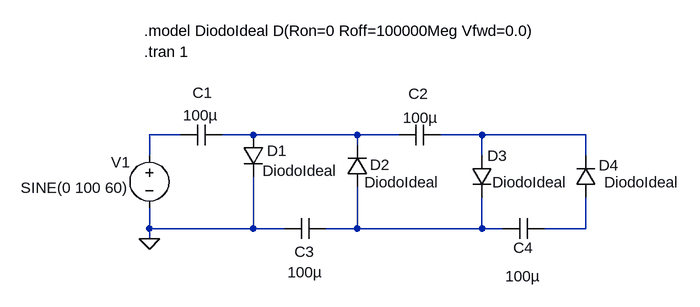
[diagram p0: schematic P1A06-Multiplicador-LTSpice.asc]
P1A06-Multiplicador-LTSpice.asc, the LTspice schematic file:
Version 4
SHEET 1 880 680
WIRE 80 112 32 112
WIRE 192 112 144 112
WIRE 352 112 192 112
WIRE 416 112 352 112
WIRE 544 112 480 112
WIRE 704 112 544 112
WIRE 352 128 352 112
WIRE 32 144 32 112
WIRE 544 144 544 112
WIRE 704 144 704 112
WIRE 32 256 32 224
WIRE 192 256 192 176
WIRE 192 256 32 256
WIRE 240 256 192 256
WIRE 352 256 352 192
WIRE 352 256 304 256
WIRE 544 256 544 208
WIRE 544 256 352 256
WIRE 576 256 544 256
WIRE 704 256 704 208
WIRE 704 256 640 256
WIRE 32 272 32 256
FLAG 32 272 0
SYMBOL cap 80 128 R270
WINDOW 0 65 34 VTop 2
WINDOW 3 62 31 VBottom 2
SYMATTR InstName C1
SYMATTR Value 100µ
SYMBOL cap 416 128 R270
WINDOW 0 64 30 VTop 2
WINDOW 3 58 33 VBottom 2
SYMATTR InstName C2
SYMATTR Value 100µ
SYMBOL cap 240 272 R270
WINDOW 0 -35 31 VTop 2
WINDOW 3 -36 32 VBottom 2
SYMATTR InstName C3
SYMATTR Value 100µ
SYMBOL cap 576 272 R270
WINDOW 0 -29 32 VTop 2
WINDOW 3 -42 31 VBottom 2
SYMATTR InstName C4
SYMATTR Value 100µ
SYMBOL diode 176 112 R0
WINDOW 0 37 24 Left 2
WINDOW 3 30 55 Left 2
SYMATTR InstName D1
SYMATTR Value DiodoIdeal
SYMBOL diode 368 192 R180
WINDOW 0 -34 34 Left 2
WINDOW 3 -111 7 Left 2
SYMATTR InstName D2
SYMATTR Value DiodoIdeal
SYMBOL diode 528 144 R0
WINDOW 3 32 41 Left 2
SYMATTR InstName D3
SYMATTR Value DiodoIdeal
SYMBOL diode 720 208 R180
WINDOW 0 -35 49 Left 2
WINDOW 3 -128 23 Left 2
SYMATTR InstName D4
SYMATTR Value DiodoIdeal
SYMBOL voltage 32 128 R0
WINDOW 123 0 0 Left 2
WINDOW 39 0 0 Left 2
WINDOW 0 -59 26 Left 2
WINDOW 3 -198 65 Left 2
SYMATTR InstName V1
SYMATTR Value SINE(0 100 60)
TEXT 24 -16 Left 2 !.tran 1
TEXT 24 -48 Left 2 !.model DiodoIdeal D(Ron=0 Roff=100000Meg Vfwd=0.0)

The netlist it stands for:
* P1A06-Multiplicador-LTSpice.asc
C1 N001 N002 100µ
C2 N002 N003 100µ
C3 0 N004 100µ
C4 N004 N005 100µ
D1 N002 0 DiodoIdeal
D2 N004 N002 DiodoIdeal
D3 N003 N004 DiodoIdeal
D4 N005 N003 DiodoIdeal
V1 N001 0 SINE(0 100 60)
.model D D
.lib standard.dio
.tran 1
.model DiodoIdeal D(Ron=0 Roff=100000Meg Vfwd=0.0)
.backanno
.end